# EAGLE schematic debug-port-plug (EAGLE 9.6.1)
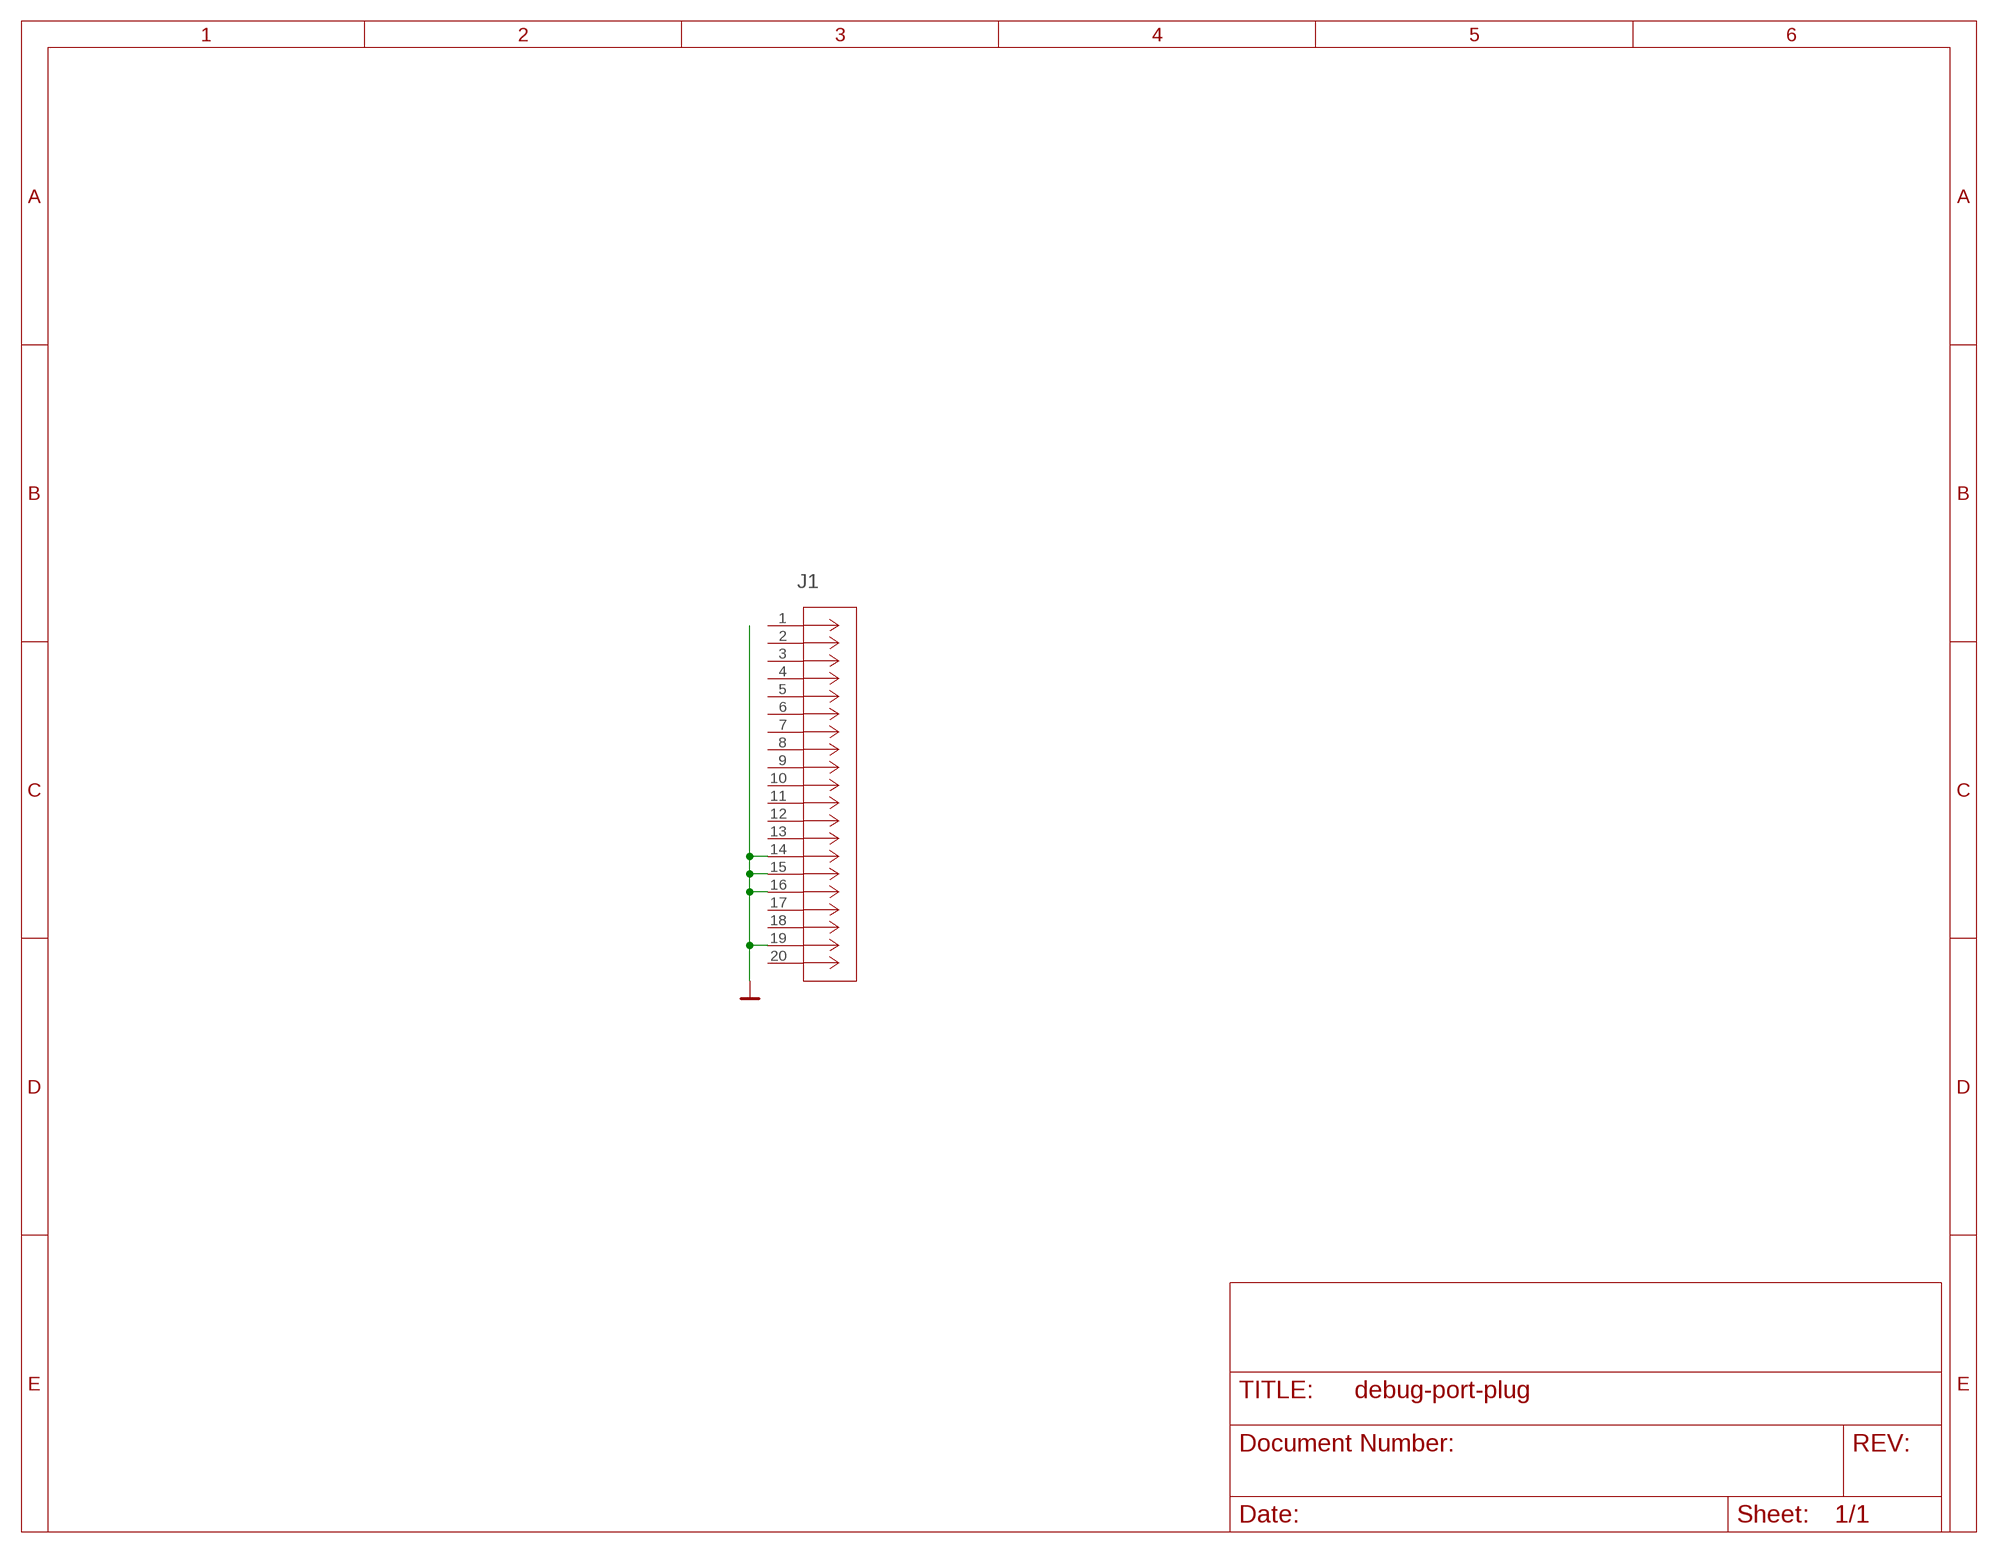
[diagram p0: schematic, sheet 1]

## Parts
J1  M50-3101045  [CONN20_M50-3101045_HRW]

## Nets
GND: J1.14 J1.15 J1.16 J1.19
Unconnected: J1.1 J1.2 J1.3 J1.4 J1.5 J1.6 J1.7 J1.8 J1.9 J1.10 J1.11 J1.12 J1.13 J1.17 J1.18 J1.20

## Library data of the parts
J1 = J-Harwin-M50-3101045-20pin-F-SMT-1.27mm:M50-3101045; BUILT_BY: EMA_Kyle; COPYRIGHT: Copyright (C) 2018 Accelerated Designs. All rights reserved; DATASHEET: https://cdn.harwin.com/pdfs/M50-310.pdf; MANUFACTURER_PART_NUMBER: M50-3101045; SOURCELIBRARY: Harwin_2020-02-18; VENDOR: Harwin